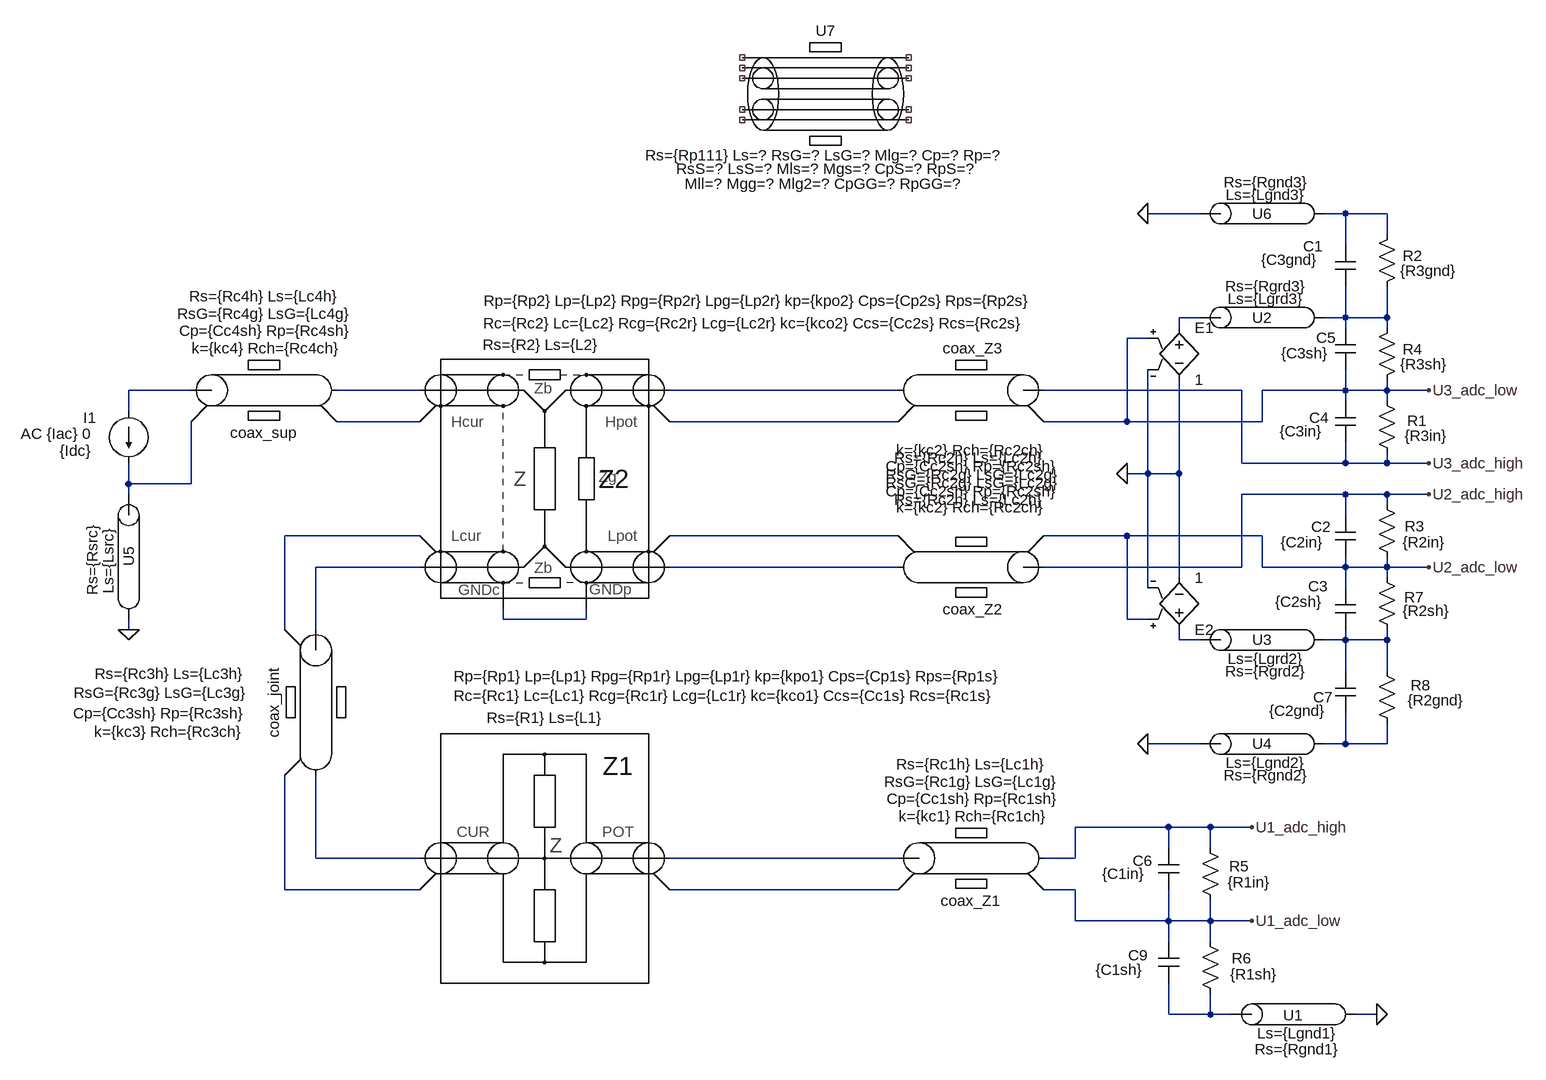
[diagram p0: schematic LiB_brg2.asc]
LiB_brg2.asc, the LTspice schematic file:
Version 4
SHEET 1 4400 2632
WIRE 656 -2128 576 -2128
WIRE 880 -2128 848 -2128
WIRE 944 -2128 880 -2128
WIRE 944 -2096 944 -2128
WIRE 880 -2080 880 -2128
WIRE 656 -1968 624 -1968
WIRE 880 -1968 880 -2016
WIRE 880 -1968 848 -1968
WIRE 944 -1968 944 -2016
WIRE 944 -1968 880 -1968
WIRE 624 -1952 624 -1968
WIRE 880 -1952 880 -1968
WIRE 944 -1952 944 -1968
WIRE 576 -1936 544 -1936
WIRE -896 -1856 -992 -1856
WIRE -544 -1856 -672 -1856
WIRE 192 -1856 -160 -1856
WIRE 720 -1856 416 -1856
WIRE 880 -1856 880 -1888
WIRE 880 -1856 752 -1856
WIRE 944 -1856 944 -1872
WIRE 944 -1856 880 -1856
WIRE 1008 -1856 944 -1856
WIRE 880 -1840 880 -1856
WIRE 944 -1840 944 -1856
WIRE -992 -1824 -992 -1856
WIRE -544 -1808 -672 -1808
WIRE 192 -1808 -160 -1808
WIRE 544 -1808 544 -1936
WIRE 544 -1808 416 -1808
WIRE 752 -1808 752 -1856
WIRE 752 -1808 544 -1808
WIRE 720 -1744 720 -1856
WIRE 880 -1744 880 -1776
WIRE 880 -1744 720 -1744
WIRE 944 -1744 944 -1760
WIRE 944 -1744 880 -1744
WIRE 1008 -1744 944 -1744
WIRE 576 -1728 576 -1888
WIRE 576 -1728 544 -1728
WIRE 624 -1728 624 -1872
WIRE 624 -1728 576 -1728
WIRE -992 -1712 -992 -1744
WIRE -896 -1712 -896 -1808
WIRE -896 -1712 -992 -1712
WIRE -992 -1696 -992 -1712
WIRE 880 -1696 720 -1696
WIRE 944 -1696 880 -1696
WIRE 1008 -1696 944 -1696
WIRE 944 -1680 944 -1696
WIRE 880 -1664 880 -1696
WIRE -544 -1632 -752 -1632
WIRE 192 -1632 -160 -1632
WIRE 544 -1632 416 -1632
WIRE 752 -1632 544 -1632
WIRE -544 -1584 -704 -1584
WIRE 192 -1584 -160 -1584
WIRE 720 -1584 720 -1696
WIRE 720 -1584 416 -1584
WIRE 752 -1584 752 -1632
WIRE 880 -1584 880 -1600
WIRE 880 -1584 752 -1584
WIRE 944 -1584 944 -1600
WIRE 944 -1584 880 -1584
WIRE 1008 -1584 944 -1584
WIRE 624 -1568 624 -1728
WIRE 944 -1568 944 -1584
WIRE 576 -1552 576 -1728
WIRE 880 -1552 880 -1584
WIRE -416 -1504 -416 -1520
WIRE -288 -1504 -288 -1520
WIRE -288 -1504 -416 -1504
WIRE 544 -1504 544 -1632
WIRE 576 -1504 544 -1504
WIRE -992 -1488 -992 -1504
WIRE -752 -1488 -752 -1632
WIRE -704 -1488 -704 -1584
WIRE 624 -1472 624 -1488
WIRE 656 -1472 624 -1472
WIRE 880 -1472 880 -1488
WIRE 880 -1472 848 -1472
WIRE 944 -1472 944 -1488
WIRE 944 -1472 880 -1472
WIRE 880 -1424 880 -1472
WIRE 944 -1424 944 -1472
WIRE 656 -1312 576 -1312
WIRE 880 -1312 880 -1360
WIRE 880 -1312 848 -1312
WIRE 944 -1312 944 -1344
WIRE 944 -1312 880 -1312
WIRE 608 -1184 464 -1184
WIRE 672 -1184 608 -1184
WIRE 736 -1184 672 -1184
WIRE 608 -1152 608 -1184
WIRE 672 -1152 672 -1184
WIRE -704 -1136 -704 -1264
WIRE -544 -1136 -704 -1136
WIRE 192 -1136 -160 -1136
WIRE 464 -1136 464 -1184
WIRE 464 -1136 416 -1136
WIRE -752 -1088 -752 -1264
WIRE -544 -1088 -752 -1088
WIRE 192 -1088 -160 -1088
WIRE 464 -1088 416 -1088
WIRE 464 -1040 464 -1088
WIRE 608 -1040 608 -1088
WIRE 608 -1040 464 -1040
WIRE 672 -1040 672 -1072
WIRE 672 -1040 608 -1040
WIRE 736 -1040 672 -1040
WIRE 608 -1008 608 -1040
WIRE 672 -1008 672 -1040
WIRE 608 -896 608 -944
WIRE 672 -896 672 -928
WIRE 672 -896 608 -896
WIRE 704 -896 672 -896
WIRE 928 -896 896 -896
FLAG 928 -896 0
FLAG -992 -1488 0
FLAG 736 -1040 U1_adc_low
FLAG 736 -1184 U1_adc_high
FLAG 1008 -1584 U2_adc_low
FLAG 1008 -1856 U3_adc_low
FLAG 576 -2128 0
FLAG 1008 -1744 U3_adc_high
FLAG 1008 -1696 U2_adc_high
FLAG 576 -1312 0
FLAG 544 -1728 0
SYMBOL std_coax -448 -1088 R0
WINDOW 0 209 -190 Center 4
WINDOW 3 386 -328 Center 2
WINDOW 123 376 -298 Center 2
WINDOW 39 97 -264 Center 2
SYMATTR InstName Z1
SYMATTR Value Rp={Rp1} Lp={Lp1} Rpg={Rp1r} Lpg={Lp1r} kp={kpo1} Cps={Cp1s} Rps={Rp1s}
SYMATTR Value2 Rc={Rc1} Lc={Lc1} Rcg={Rc1r} Lcg={Lc1r} kc={kco1} Ccs={Cc1s} Rcs={Rc1s}
SYMATTR SpiceLine Rs={R1} Ls={L1}
SYMBOL coax_cable -704 -1376 R90
WINDOW 0 0 65 Center 2
WINDOW 3 -44 224 VCenter 2
WINDOW 123 -15 238 VCenter 2
WINDOW 39 45 227 VCenter 2
WINDOW 40 17 240 VCenter 2
SYMATTR InstName coax_joint
SYMATTR Value Rs={Rc3h} Ls={Lc3h}
SYMATTR Value2 RsG={Rc3g} LsG={Lc3g}
SYMATTR SpiceLine k={kc3} Rch={Rc3ch}
SYMATTR SpiceLine2 Cp={Cc3sh} Rp={Rc3sh}
SYMBOL coax_cable -784 -1856 R0
WINDOW 0 0 65 Center 2
WINDOW 3 1 -145 Center 2
WINDOW 123 1 -118 Center 2
WINDOW 39 3 -65 Center 2
WINDOW 40 3 -92 Center 2
SYMATTR InstName coax_sup
SYMATTR Value Rs={Rc4h} Ls={Lc4h}
SYMATTR Value2 RsG={Rc4g} LsG={Lc4g}
SYMATTR SpiceLine k={kc4} Rch={Rc4ch}
SYMATTR SpiceLine2 Cp={Cc4sh} Rp={Rc4sh}
SYMBOL current -992 -1824 R0
WINDOW 0 -70 10 Left 2
WINDOW 3 -106 61 Left 2
WINDOW 123 -166 35 Left 2
SYMATTR InstName I1
SYMATTR Value {Idc}
SYMATTR Value2 AC {Iac} 0
SYMBOL coax_cable 304 -1584 R180
WINDOW 0 -3 -65 Center 2
WINDOW 3 2 168 Center 2
WINDOW 123 -3 142 Center 2
WINDOW 39 1 92 Center 2
WINDOW 40 -2 117 Center 2
SYMATTR InstName coax_Z2
SYMATTR Value Rs={Rc2h} Ls={Lc2h}
SYMATTR Value2 RsG={Rc2g} LsG={Lc2g}
SYMATTR SpiceLine k={kc2} Rch={Rc2ch}
SYMATTR SpiceLine2 Cp={Cc2sh} Rp={Rc2sh}
SYMBOL coax_cable 304 -1136 R0
WINDOW 0 0 65 Center 2
WINDOW 3 1 -145 Center 2
WINDOW 123 1 -118 Center 2
WINDOW 39 3 -65 Center 2
WINDOW 40 3 -92 Center 2
SYMATTR InstName coax_Z1
SYMATTR Value Rs={Rc1h} Ls={Lc1h}
SYMATTR Value2 RsG={Rc1g} LsG={Lc1g}
SYMATTR SpiceLine k={kc1} Rch={Rc1ch}
SYMATTR SpiceLine2 Cp={Cc1sh} Rp={Rc1sh}
SYMBOL cap 864 -1664 R0
WINDOW 0 -37 18 Left 2
WINDOW 3 -84 42 Left 2
SYMATTR InstName C2
SYMATTR Value {C2in}
SYMBOL res 928 -1696 R0
WINDOW 0 43 49 Left 2
WINDOW 3 40 74 Left 2
SYMATTR InstName R3
SYMATTR Value {R2in}
SYMBOL cap 864 -1888 M180
WINDOW 0 -29 49 Left 2
WINDOW 3 -83 25 Left 2
SYMATTR InstName C5
SYMATTR Value {C3sh}
SYMBOL res 928 -1856 M180
WINDOW 0 40 63 Left 2
WINDOW 3 36 40 Left 2
SYMATTR InstName R4
SYMATTR Value {R3sh}
SYMBOL cap 592 -1152 R0
WINDOW 0 -39 20 Left 2
WINDOW 3 -86 40 Left 2
SYMATTR InstName C6
SYMATTR Value {C1in}
SYMBOL res 656 -1168 R0
WINDOW 0 45 44 Left 2
WINDOW 3 43 69 Left 2
SYMATTR InstName R5
SYMATTR Value {R1in}
SYMBOL cap 592 -1008 R0
WINDOW 0 -46 21 Left 2
WINDOW 3 -96 43 Left 2
SYMATTR InstName C9
SYMATTR Value {C1sh}
SYMBOL res 656 -1024 R0
WINDOW 0 49 42 Left 2
WINDOW 3 47 66 Left 2
SYMATTR InstName R6
SYMATTR Value {R1sh}
SYMBOL ground_lug 752 -1968 M180
SYMATTR InstName U2
SYMATTR Value Rs={Rgrd3}
SYMATTR Value2 Ls={Lgrd3}
SYMBOL ground_lug 800 -896 R0
WINDOW 0 -16 1 Left 2
WINDOW 3 6 54 Center 2
SYMATTR InstName U1
SYMATTR Value Rs={Rgnd1}
SYMATTR Value2 Ls={Lgnd1}
SYMBOL ground_lug -992 -1600 R90
WINDOW 3 5 56 Center 2
WINDOW 123 6 31 Center 2
SYMATTR Value Rs={Rsrc}
SYMATTR Value2 Ls={Lsrc}
SYMATTR InstName U5
SYMBOL std_4TP2 -256 -1808 M0
WINDOW 0 -11 89 Center 4
WINDOW 3 -240 -186 Center 2
WINDOW 123 -229 -151 Center 2
WINDOW 39 101 -118 Center 2
SYMATTR InstName Z2
SYMATTR Value Rp={Rp2} Lp={Lp2} Rpg={Rp2r} Lpg={Lp2r} kp={kpo2} Cps={Cp2s} Rps={Rp2s}
SYMATTR Value2 Rc={Rc2} Lc={Lc2} Rcg={Rc2r} Lcg={Lc2r} kc={kco2} Ccs={Cc2s} Rcs={Rc2s}
SYMATTR SpiceLine Rs={R2} Ls={L2}
SYMBOL res 928 -2000 M180
WINDOW 0 40 63 Left 2
WINDOW 3 36 40 Left 2
SYMATTR InstName R2
SYMATTR Value {R3gnd}
SYMBOL cap 864 -2016 M180
WINDOW 0 -49 62 Left 2
WINDOW 3 -114 41 Left 2
SYMATTR InstName C1
SYMATTR Value {C3gnd}
SYMBOL ground_lug 752 -2128 M180
SYMATTR InstName U6
SYMATTR Value Rs={Rgnd3}
SYMATTR Value2 Ls={Lgnd3}
SYMBOL coax_cable 304 -1856 M0
WINDOW 0 -3 -65 Center 2
WINDOW 3 2 168 Center 2
WINDOW 123 -3 142 Center 2
WINDOW 39 1 92 Center 2
WINDOW 40 -2 117 Center 2
SYMATTR InstName coax_Z3
SYMATTR Value Rs={Rc2h} Ls={Lc2h}
SYMATTR Value2 RsG={Rc2g} LsG={Lc2g}
SYMATTR SpiceLine k={kc2} Rch={Rc2ch}
SYMATTR SpiceLine2 Cp={Cc2sh} Rp={Rc2sh}
SYMBOL cap 864 -1840 R0
WINDOW 0 -40 26 Left 2
WINDOW 3 -85 47 Left 2
SYMATTR InstName C4
SYMATTR Value {C3in}
SYMBOL res 928 -1856 R0
WINDOW 0 47 47 Left 2
WINDOW 3 43 70 Left 2
SYMATTR InstName R1
SYMATTR Value {R3in}
SYMBOL cap 864 -1552 R0
WINDOW 0 -41 -3 Left 2
WINDOW 3 -92 21 Left 2
SYMATTR InstName C3
SYMATTR Value {C2sh}
SYMBOL res 928 -1584 R0
WINDOW 0 42 46 Left 2
WINDOW 3 40 67 Left 2
SYMATTR InstName R7
SYMATTR Value {R2sh}
SYMBOL ground_lug 752 -1472 R0
SYMATTR InstName U3
SYMATTR Value Rs={Rgrd2}
SYMATTR Value2 Ls={Lgrd2}
SYMBOL res 928 -1440 R0
WINDOW 0 52 38 Left 2
WINDOW 3 48 61 Left 2
SYMATTR InstName R8
SYMATTR Value {R2gnd}
SYMBOL cap 864 -1424 R0
WINDOW 0 -34 40 Left 2
WINDOW 3 -101 61 Left 2
SYMATTR InstName C7
SYMATTR Value {C2gnd}
SYMBOL ground_lug 752 -1312 R0
SYMATTR InstName U4
SYMATTR Value Rs={Rgnd2}
SYMATTR Value2 Ls={Lgnd2}
SYMBOL e 624 -1968 R0
SYMATTR InstName E1
SYMATTR Value 1
SYMBOL e 624 -1472 M180
SYMATTR InstName E2
SYMATTR Value 1
SYMBOL twax_cable 80 -2288 R0
SYMATTR InstName U7
SYMATTR Value Rs={Rp111} Ls=? RsG=? LsG=? Mlg=? Cp=? Rp=?

The netlist it stands for:
* LiB_brg2.asc
XZ1 N018 N020 N019 N021 STDCOAX Rp={Rp1} Lp={Lp1} Rpg={Rp1r} Lpg={Lp1r} kp={kpo1} Cps={Cp1s} Rps={Rp1s} Rc={Rc1} Lc={Lc1} Rcg={Rc1r} Lcg={Lc1r} kc={kco1} Ccs={Cc1s} Rcs={Rc1s} Rs={R1} Ls={L1}  ; pins Ch Cl Ph Pl
Xcoax_joint N012 N018 N010 N020 COAXCAB Rs={Rc3h} Ls={Lc3h} RsG={Rc3g} LsG={Lc3g} k={kc3} Rch={Rc3ch} Cp={Cc3sh} Rp={Rc3sh}  ; pins LA LB RA RB
Xcoax_sup N004 N005 N009 N007 COAXCAB Rs={Rc4h} Ls={Lc4h} RsG={Rc4g} LsG={Lc4g} k={kc4} Rch={Rc4ch} Cp={Cc4sh} Rp={Rc4sh}  ; pins LA LB RA RB
I1 N004 N009 {Idc} AC {Iac} 0
Xcoax_Z2 U2_adc_high N013 U2_adc_low N011 COAXCAB Rs={Rc2h} Ls={Lc2h} RsG={Rc2g} LsG={Lc2g} k={kc2} Rch={Rc2ch} Cp={Cc2sh} Rp={Rc2sh}  ; pins LA LB RA RB
Xcoax_Z1 N019 U1_adc_high N021 U1_adc_low COAXCAB Rs={Rc1h} Ls={Lc1h} RsG={Rc1g} LsG={Lc1g} k={kc1} Rch={Rc1ch} Cp={Cc1sh} Rp={Rc1sh}  ; pins LA LB RA RB
C2 U2_adc_high U2_adc_low {C2in}
R3 U2_adc_high U2_adc_low {R2in}
C5 U3_adc_low N003 {C3sh}
R4 U3_adc_low N003 {R3sh}
C6 U1_adc_high U1_adc_low {C1in}
R5 U1_adc_high U1_adc_low {R1in}
C9 U1_adc_low N022 {C1sh}
R6 U1_adc_low N022 {R1sh}
XU2 N002 N003 GNDLUG Rs={Rgrd3} Ls={Lgrd3}  ; pins LA LB
XU1 N022 0 GNDLUG Rs={Rgnd1} Ls={Lgnd1}  ; pins LA LB
XU5 N009 0 GNDLUG Rs={Rsrc} Ls={Lsrc}  ; pins LA LB
XZ2 N006 N008 N013 N011 N005 N007 N012 N010 N014 N014 STD4TP3 Rp={Rp2} Lp={Lp2} Rpg={Rp2r} Lpg={Lp2r} kp={kpo2} Cps={Cp2s} Rps={Rp2s} Rc={Rc2} Lc={Lc2} Rcg={Rc2r} Lcg={Lc2r} kc={kco2} Ccs={Cc2s} Rcs={Rc2s} Rs={R2} Ls={L2}  ; pins Hp HpG Lp LpG Hc HcG Lc LcG Gpot Gcur
R2 N003 N001 {R3gnd}
C1 N003 N001 {C3gnd}
XU6 0 N001 GNDLUG Rs={Rgnd3} Ls={Lgnd3}  ; pins LA LB
Xcoax_Z3 U3_adc_high N006 U3_adc_low N008 COAXCAB Rs={Rc2h} Ls={Lc2h} RsG={Rc2g} LsG={Lc2g} k={kc2} Rch={Rc2ch} Cp={Cc2sh} Rp={Rc2sh}  ; pins LA LB RA RB
C4 U3_adc_low U3_adc_high {C3in}
R1 U3_adc_low U3_adc_high {R3in}
C3 U2_adc_low N016 {C2sh}
R7 U2_adc_low N016 {R2sh}
XU3 N015 N016 GNDLUG Rs={Rgrd2} Ls={Lgrd2}  ; pins LA LB
R8 N016 N017 {R2gnd}
C7 N016 N017 {C2gnd}
XU4 0 N017 GNDLUG Rs={Rgnd2} Ls={Lgnd2}  ; pins LA LB
E1 N002 0 U3_adc_low 0 1
E2 N015 0 U2_adc_low 0 1
XU7 NC_01 NC_02 NC_03 NC_04 NC_05 NC_06 NC_07 NC_08 NC_09 NC_10 TWAXSH Rs={Rp111} Ls=? RsG=? LsG=? Mlg=? Cp=? Rp=? RsS=? LsS=? Mls=? Mgs=? CpS=? RpS=? Mll=? Mgg=? Mlg2=? CpGG=? RpGG=?  ; pins AL1 AG1 BL1 BG1 SH1 BL1 BG1 BL2 BG2 SH1
.lib ZbrgLib.cir ZbrgLib
.backanno
.end